# Altium schematic sheet Power_Regulation.SchDoc
size A
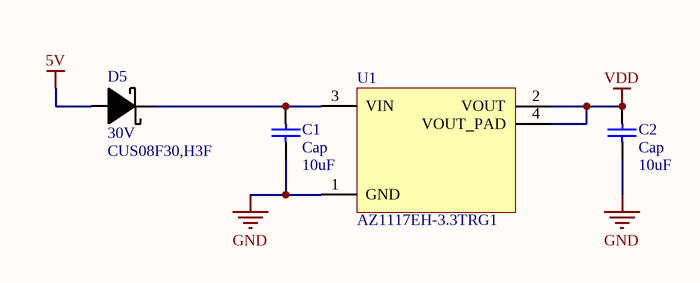
[diagram p0: Power_Regulation.SchDoc]

## Parts
C1  Cap  value 10uF  [C0805]
C2  Cap  value 10uF  [C0805]
D5  Voltage - DC Reverse (Vr) (Max): 30V  Manufacturer Part Number: CUS08F30,H3F  [SOD323]  (hidden comment: Schottky Diode)
U1  Manufacturer Part Number: AZ1117EH-3.3TRG1  [SOT223]  (hidden comment: U_AZ1117EH-3.3TRG1)

## Nets
5V: D5.2(AN)
GND: C1.1 C2.1 U1.1(GND)
VDD: C2.2 U1.2(VOUT) U1.4(VOUT_PAD)
NetC1_2: C1.2 D5.1(CA) U1.3(VIN)

## Library data of the parts
C1 C2 = Cap: Capacitor; Published: 8-Jun-2000; LatestRevisionDate: 17-Jul-2002; LatestRevisionNote: Re-released for DXP Platform.; PackageReference: C1206; Publisher: Altium Limited
D5 = DS_CUS08F30: Diode Schottky 30V 800mA (DC) Surface Mount SOD-323; Manufacturer: Toshiba Semiconductor and Storage; Voltage - Forward (Vf) (Max) @ If: 220mV @ 10mA; Speed: Fast Recovery =< 500ns, > 200mA (Io); Current - Reverse Leakage @ Vr: 50µA @ 30V; Capacitance @ Vr, F: 170pF @ 0V, 1MHz; Packaging: Cut Tape (CT); Part Status: Active; Diode Type: Schottky; Current - Average Rectified (Io): 800mA; Reverse Recovery Time (trr): -; Mounting Type: Surface Mount; Package / Case: SC-76, SOD-323; Supplier Device Package: USC; Operating Temperature - Junction: 125°C (Max); ComponentLink1URL: https://toshiba.semicon-storage.com/info/docget.jsp?did=9019&prodName=CUS08F30; ComponentLink1Description: https://toshiba.semicon-storage.com/info/docget.jsp?did=9019&prodName=CUS08F30; Supplier 1: Digi-Key; Supplier Part Number 1: CUS08F30H3FCT-ND; RoHS: RoHS Compliant; Category: Discrete Semiconductor Products; Stock 1: 5288; Pricing 1: 1=0.49, 10=0.448, 25=0.3224, 100=0.2508, 250=0.15764, 500=0.13438, 1000=0.09138 (CAD)
U1 = U_AZ1117EH-3.3TRG1: IC LDO 3.3V 1A; Manufacturer: Diodes Incorporated; Regulator Topology: Positive Fixed; Voltage - Dropout (Typical): 1.1V @ 1A; Number of Regulators: 1; Voltage - Input: Up to 13V; Supplier 1: Digi-Key; Supplier Part Number 1: AZ1117EH-3.3TRG1DICT-ND; RoHS: RoHS Compliant; Category: Integrated Circuits (ICs); Stock 1: 13427; Pricing: 1=0.61, 10=0.456, 100=0.2578, 500=0.1709, 1000=0.13108 (CAD); Packaging: Cut Tape (CT); Voltage - Output: 3.3V; Current - Output: 1A; Current - Limit (Min): -; Operating Temperature: -40°C ~ 125°C; Mounting Type: Surface Mount; Package / Case: TO-261-4, TO-261AA; Supplier Device Package: SOT-223; ComponentLink1URL: http://www.diodes.com/_files/datasheets/AZ1117E.pdf; ComponentLink1Description: http://www.diodes.com/_files/datasheets/AZ1117E.pdf